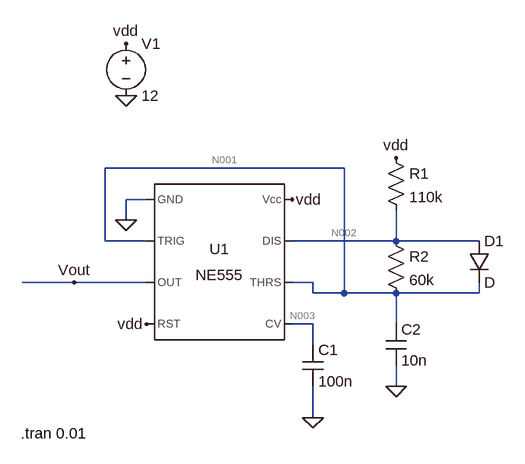
[diagram p0: schematic PWM_Generator_555.asc]
PWM_Generator_555.asc, the LTspice schematic file:
Version 4
SHEET 1 880 968
WIRE 400 80 32 80
WIRE 96 128 64 128
WIRE 64 160 64 128
WIRE 32 192 32 80
WIRE 96 192 32 192
WIRE 480 192 480 144
WIRE 480 192 320 192
WIRE 608 192 480 192
WIRE -16 256 -96 256
WIRE 96 256 -16 256
WIRE 352 256 320 256
WIRE 352 272 352 256
WIRE 400 272 400 80
WIRE 400 272 352 272
WIRE 480 272 400 272
WIRE 608 272 608 256
WIRE 608 272 480 272
WIRE 352 320 320 320
WIRE 480 320 480 272
WIRE 352 352 352 320
WIRE 480 416 480 384
WIRE 352 464 352 416
FLAG 64 -32 0
FLAG 64 -112 vdd
FLAG 320 128 vdd
FLAG 96 320 vdd
FLAG 480 64 vdd
FLAG 352 464 0
FLAG 64 160 0
FLAG 480 416 0
FLAG -16 256 Vout
SYMBOL Misc\\NE555 208 224 R0
SYMATTR InstName U1
SYMBOL voltage 64 -128 R0
WINDOW 123 0 0 Left 0
WINDOW 39 0 0 Left 0
SYMATTR InstName V1
SYMATTR Value 12
SYMBOL res 464 48 R0
SYMATTR InstName R1
SYMATTR Value 110k
SYMBOL res 464 176 R0
SYMATTR InstName R2
SYMATTR Value 60k
SYMBOL diode 592 192 R0
SYMATTR InstName D1
SYMBOL cap 336 352 R0
SYMATTR InstName C1
SYMATTR Value 100n
SYMBOL cap 464 320 R0
SYMATTR InstName C2
SYMATTR Value 10n
TEXT -98 488 Left 2 !.tran 0.01

The netlist it stands for:
* PWM_Generator_555.asc
XU1 0 N001 Vout vdd N003 N001 N002 vdd NE555  ; pins GND TRIG OUT RST CV THRS DIS Vcc
V1 vdd 0 12
R1 vdd N002 110k
R2 N002 N001 60k
D1 N002 N001 D
C1 N003 0 100n
C2 N001 0 10n
.model D D
.lib standard.dio
.tran 0.01
.lib NE555.sub
.backanno
.end

* Results of the author's LTspice run, read from the files saved beside the schematic
* Operating Point, zero values left out:
*   V(n001) = 11.99 V
*   V(n003) = 8 V
*   V(vdd) = 12 V
*   V(n002) = 12 V
*   V(vout) = 12 V
*   I(R2) = 23.99 nA
*   I(R1) = 39.99 nA
*   I(V1) = -3.881 mA
*   Ix(u1:1) = -3.881 mA
*   Ix(u1:2) = 11.99 nA
*   Ix(u1:4) = 69.33 µA
*   Ix(u1:6) = 11.99 nA
*   Ix(u1:7) = 16.01 nA
*   Ix(u1:8) = 3.812 mA
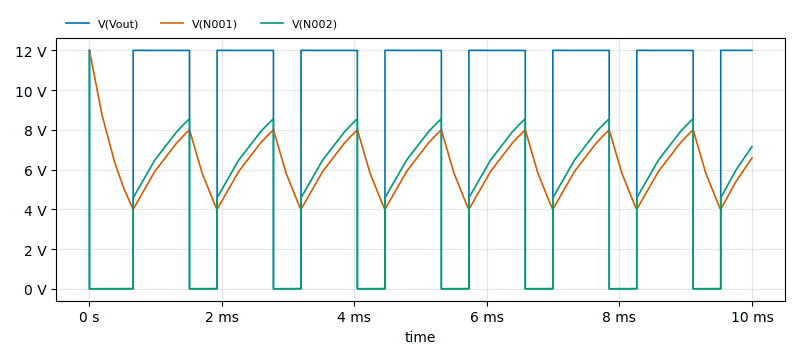
[diagram p1: Transient Analysis of PWM_Generator_555.asc, plotted from the saved traces]
* Transient Analysis, 1 run:
*   V(Vout): min 72 µV, max 12 V, average 7.712 V, rms 9.62 V, last 12 V
*   V(N001): min 3.999 V, max 11.99 V, average 6.136 V, rms 6.312 V, last 6.582 V
*   V(N002): min 1.054 mV, max 12 V, average 4.325 V, rms 5.494 V, last 7.15 V